# EAGLE design v2-controller (EAGLE 7.5.0)
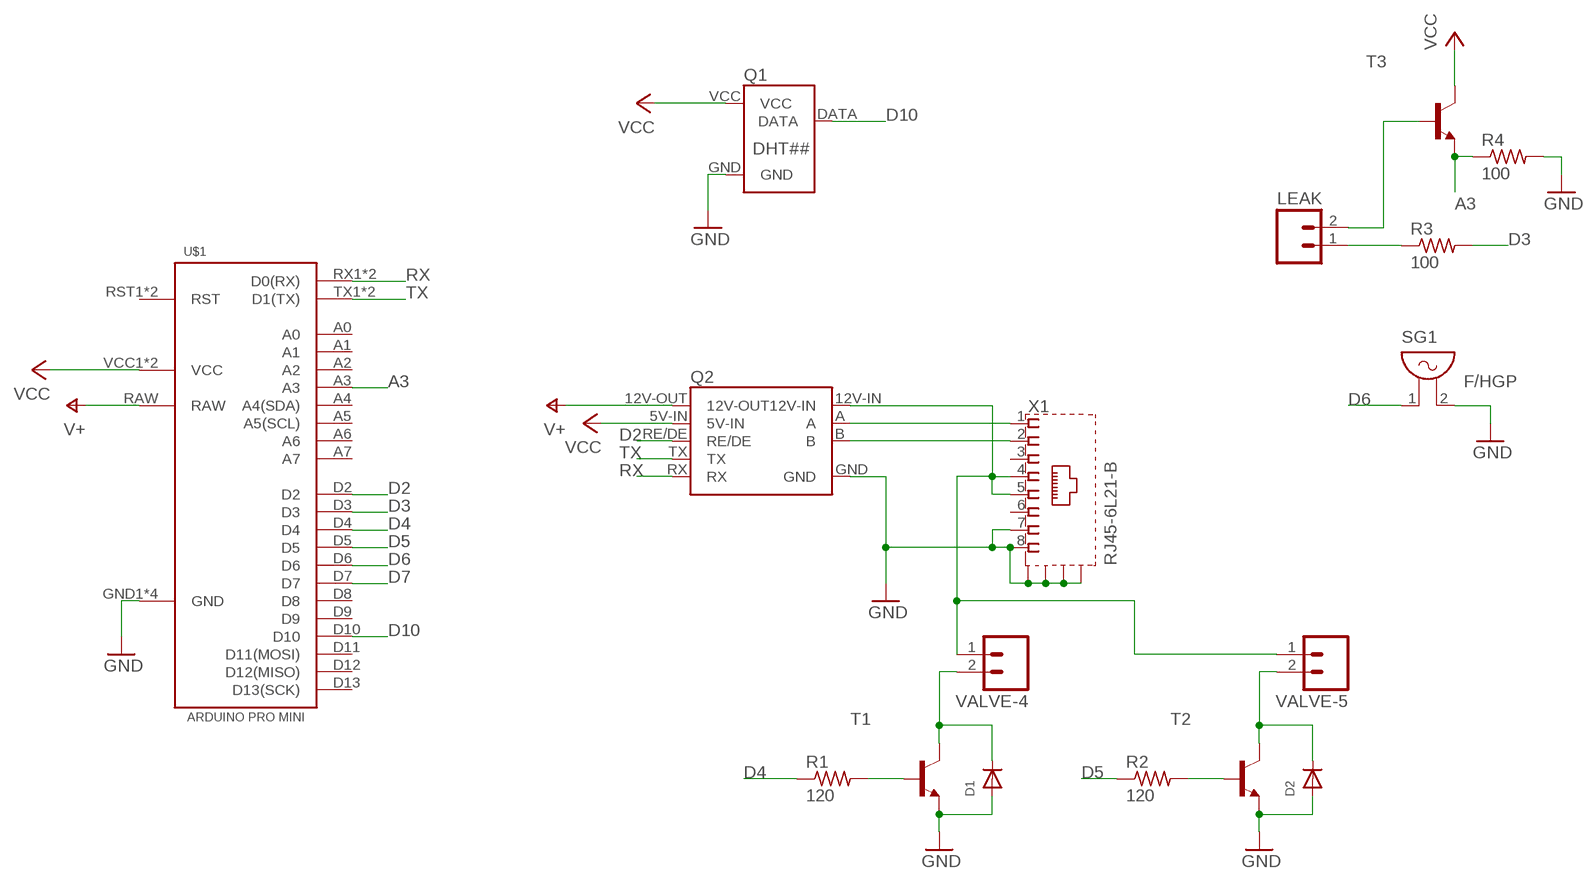
[diagram p0: schematic, sheet 1]

## Parts
D1  DIODESMA  [SMADIODE]
D2  DIODESMA  [SMADIODE]
LEAK  M02  [02P]
Q1  DHT##  [CONNECTOR-4-PIN-0.1]
Q2  RS485-ADAPTER0.05-CONNECTOR  [RS485-ADAPTOR-05]
R1  120  R-US_R0603  [R0603]
R2  120  R-US_R0603  [R0603]
R3  100  R-US_R0603  [R0603]
R4  100  R-US_R0603  [R0603]
SG1  F/HGP  [F/HGP]
T1  BC808-NPN-SOT23-BEC  [SOT23-BEC]
T2  BC808-NPN-SOT23-BEC  [SOT23-BEC]
T3  BC808-NPN-SOT23-BEC  [SOT23-BEC]
U$1  ARDUINO-PRO-MINI  [ARDUINO-PRO-MINI]
VALVE-4  M02  [02P]
VALVE-5  M02  [02P]
X1  RJ45-6L21-B  [RJ45-SHIELD1]

## Nets
A3: R4.1 T3.E U$1.A3
D2: Q2.RE/DE U$1.D2
D3: R3.2 U$1.D3
D4: R1.1 U$1.D4
D5: R2.1 U$1.D5
D6: SG1.1 U$1.D6
D7: U$1.D7
D10: Q1.DATA U$1.D10
GND: D1.A D2.A Q1.GND Q2.GND R4.2 SG1.2 T1.E T2.E U$1.GND1(GND) U$1.GND2(GND) U$1.GND3(GND) U$1.GND4(GND) X1.7 X1.8 X1.S1(S) X1.S2(S) X1.S3(S) X1.S4(S)
N$1: LEAK.1 R3.1
N$2: R1.2 T1.B
N$3: LEAK.2 T3.B
N$5: Q2.12V-IN VALVE-4.1 VALVE-5.1 X1.4 X1.5
N$6: D2.C T2.C VALVE-5.2
N$7: Q2.B X1.2
N$8: Q2.A X1.1
N$9: D1.C T1.C VALVE-4.2
N$10: R2.2 T2.B
RX: Q2.RX U$1.RX1(D0(RX)) U$1.RX2(D0(RX))
TX: Q2.TX U$1.TX1(D1(TX)) U$1.TX2(D1(TX))
V+: Q2.12V-OUT U$1.RAW
VCC: Q1.VCC Q2.5V-IN T3.C U$1.VCC1(VCC) U$1.VCC2(VCC)
Unconnected: U$1.A0 U$1.A1 U$1.A2 U$1.A4(A4(SDA)) U$1.A5(A5(SCL)) U$1.A6 U$1.A7 U$1.D8 U$1.D9 U$1.D11(D11(MOSI)) U$1.D12(D12(MISO)) U$1.D13(D13(SCK)) U$1.RST1(RST) U$1.RST2(RST) X1.3 X1.6

## Library data of the parts
D1 D2 = adafruit:DIODE: Diode SMADIODE - SMA Surface Mount Package 20V 1A Schottky Diode Digikey: 641-1014-6-ND DO-1N4148 - Through Hole Small Current Diode SOD-123 20V 1 A (.5mV Vf) Schottky Diode - Digikey: MBRX120TPMSCT-ND SOD-323 10V 570mA (.38mV Vf, 3ns) Schottky Diode - Digikey: ZLLS410CT-ND SOD-523 30V 30mA Schottky Diode (RB751S-40TE61) - Digikey: RB751S-40TE61CT-ND SOT23-R/W - SOT23 Package (R = Solder Paste/Reflow Ovens, W = Hand-Soldering) BAT54Film 40V 300mA - Digikey: 497-7162-1-ND
LEAK VALVE-4 VALVE-5 = con-amp-quick:M02: AMP QUICK CONNECTOR; OC_FARNELL: unknown; OC_NEWARK: unknown
Q1 = serge:DHT##
Q2 = serge:RS485-ADAPTER
R1-R4 = adafruit:R-US_: RESISTOR, American symbol
SG1 = buzzer:F/HGP: BUZZER Source: Buerklin; OC_FARNELL: unknown; OC_NEWARK: unknown
T1-T3 = transistor:*-NPN-: NPN Transistror BF959 corrected 2008.03.06
U$1 = serge:ARDUINO-PRO-MINI
X1 = con-tycoelectronics:RJ45*2: RJ45 Low Profile Shield Type 2 For all RJ45 L, LC, LCT and X Series Models Source: www.tycoelectronics.com .. ENG_DS_1654001_1099_RJ_L_0507.pdf; OC_FARNELL: unknown; OC_NEWARK: unknown

## Board
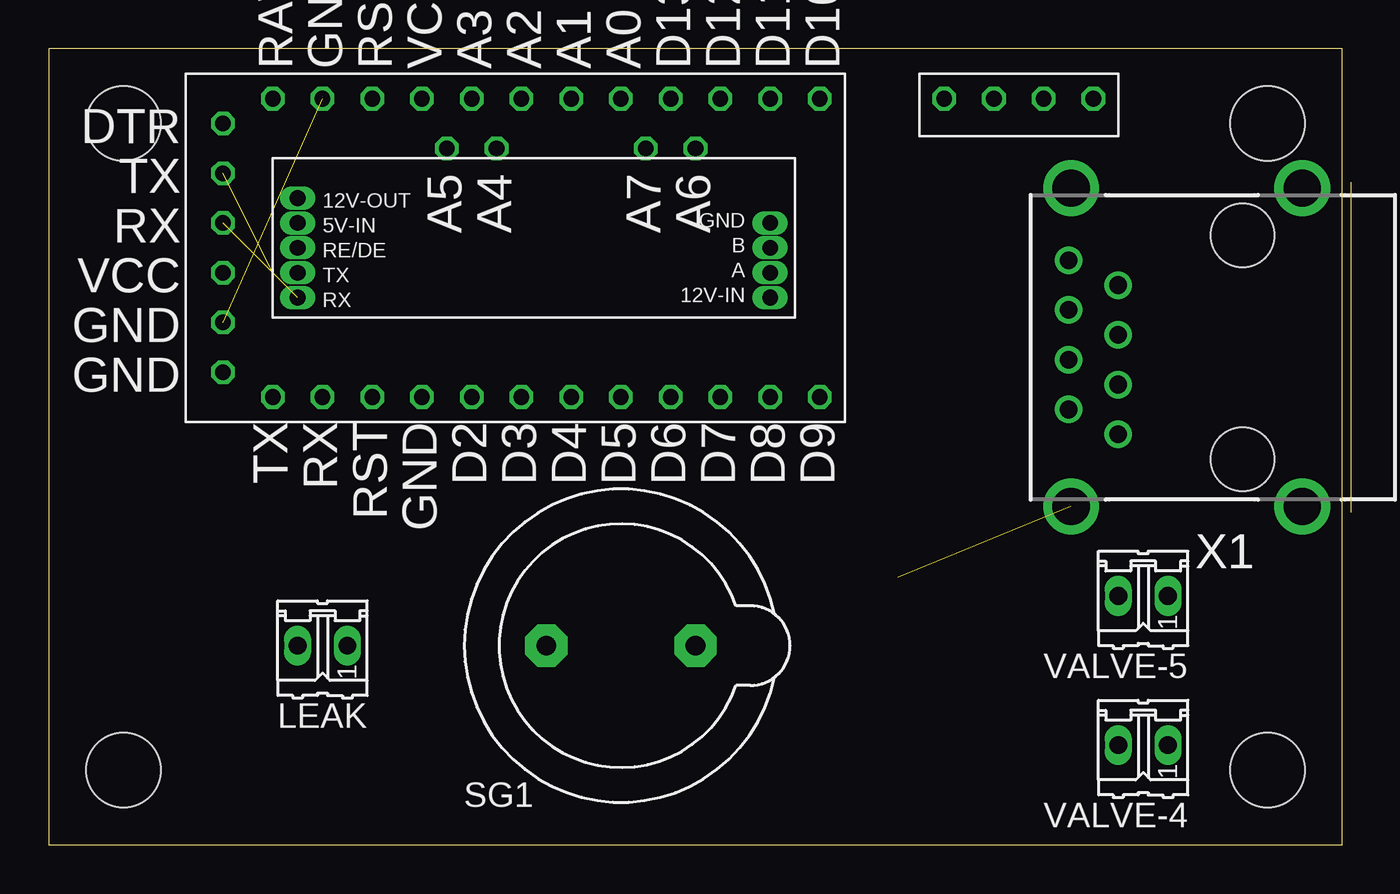
[diagram p1: board, top side]
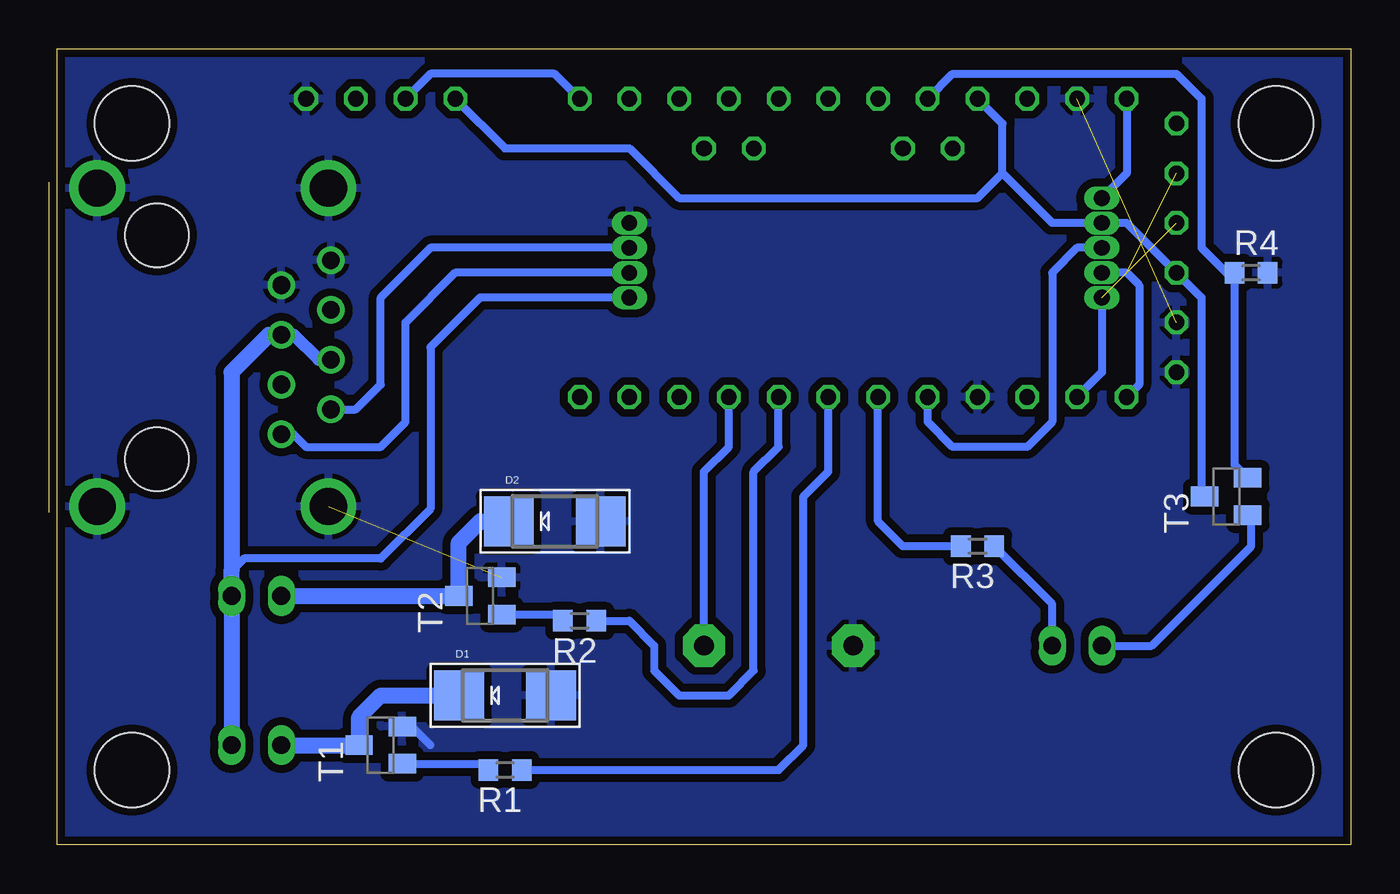
[diagram p2: board, bottom side, seen from below]

Size 66.04 x 40.64 mm. Coordinates in mm from the lower left corner, seen from the top.
Outline: 0,0 66.04,0 66.04,40.64 0,40.64 0,0
Copper layers (1*16): Top 0.035mm / dielectric 1.5mm / Bottom 0.035mm
Design rules "default *": minimum track width 10mil, minimum drill 24mil, track to track 16mil, track to pad 16mil, pad to pad 16mil, via to via 16mil, smd to smd 16mil, copper to edge 16mil, drill to drill 8mil, minimum pad ring 8mil, minimum via ring 8mil, stop-mask expansion 4mil, vias tented up to drill 0mil, thermal gap 10mil
Holes 3.81 mm at 3.81,3.81 3.81,36.83 62.23,36.83 62.23,3.81

### Footprints (pad centres in the part's own frame; a part is rotated, then mirrored left to right if it is on the bottom)
SMADIODE = smd 2.54 x 2.54: A 2.349,0; C -2.349,0
02P = drill 0.914 long: 1 -1.27,0; 2 1.27,0
CONNECTOR-4-PIN-0.1 = drill 0.8 octagon: DATA -1.27,0; GND 3.81,0; N/C 1.27,0; VCC -3.81,0
RS485-ADAPTOR-05 = drill 0.8 pad 1.016 long: 5V-IN -11.43,1.27; 12V-IN 12.7,-2.54; 12V-OUT -11.43,2.54; A 12.7,-1.27; B 12.7,0; GND 12.7,1.27; RE/DE -11.43,0; RX -11.43,-2.54; TX -11.43,-1.27
R0603 = smd 1 x 1.1: 1 -0.85,0; 2 0.85,0
F/HGP = drill 1.016 pad 2.159 octagon: 1 -3.81,0; 2 3.81,0
SOT23-BEC = smd 1 x 1.4: B -0.95,-1.1; C 0,1.1; E 0.95,-1.1
ARDUINO-PRO-MINI = drill 0.8 octagon: A0 -3.81,-7.62; A1 -1.27,-7.62; A2 1.27,-7.62; A3 3.81,-7.62; A4 2.54,-5.08; A5 5.08,-5.08; A6 -7.62,-5.08; A7 -5.08,-5.08; D2 3.81,7.62; D3 1.27,7.62; D4 -1.27,7.62; D5 -3.81,7.62; D6 -6.35,7.62; D7 -8.89,7.62; D8 -11.43,7.62; D9 -13.97,7.62; D10 -13.97,-7.62; D11 -11.43,-7.62; D12 -8.89,-7.62; D13 -6.35,-7.62; DTR 16.51,-6.35; GND1 11.43,-7.62; GND2 16.51,6.35; GND3 16.51,3.81; GND4 6.35,7.62; RAW 13.97,-7.62; RST1 8.89,7.62; RST2 8.89,-7.62; RX1 11.43,7.62; RX2 16.51,-1.27; TX1 13.97,7.62; TX2 16.51,-3.81; VCC1 16.51,1.27; VCC2 6.35,-7.62
RJ45-SHIELD1 = drill 0.9 pad 1.4: 1 -4.445,6.35; 2 -3.175,8.89; 3 -1.905,6.35; 4 -0.635,8.89; 5 0.635,6.35; 6 1.905,8.89; 7 3.175,6.35; 8 4.445,8.89 | drill 1.9 pad 2.5: S1 -8.128,-3.048; S2 8.128,-3.048; S3 -8.128,8.76; S4 8.128,8.76 | hole 3.251: -5.715,0; 5.715,0

### Placement (x,y rotation side)
D1  43.18,7.62 0 bottom
D2  40.64,16.51 0 bottom
LEAK  13.97,10.16 180 top
Q1  49.53,38.1 0 top
Q2  24.13,30.48 0 top
R1  43.18,3.81 180 bottom
R2  39.37,11.43 180 bottom
R3  19.05,15.24 180 bottom
R4  5.08,29.21 0 bottom
SG1  29.21,10.16 180 top
T1  49.53,5.08 90 bottom
T2  44.45,12.7 90 bottom
T3  6.35,17.78 90 bottom
U$1  25.4,30.48 180 top
VALVE-4  55.88,5.08 180 top
VALVE-5  55.88,12.7 180 top
X1  60.96,25.4 90 top

### Tracks (layer width: path | path; a pad name or v marks a point on that pad's centre or on a via)
A3
  Bottom 0.406: U$1.A3 20.32,39.37 8.89,39.37 7.62,38.1 7.62,30.48 6.35,29.21 R4.1 5.93,19.41 T3.E
D2
  Bottom 0.406: Q2.RE/DE 13.97,30.48 15.24,29.21 15.24,21.59 16.51,20.32 20.32,20.32 21.59,21.59 U$1.D2
D3
  Bottom 0.406: R3.2 22.86,15.24 24.13,16.51 U$1.D3
D4
  Bottom 0.406: U$1.D4 26.67,19.05 27.94,17.78 27.94,5.08 29.21,3.81 R1.1
D5
  Bottom 0.406: R2.1 36.83,11.43 35.56,10.16 35.56,8.89 34.29,7.62 31.75,7.62 30.48,8.89 30.48,19.05 29.21,20.32 U$1.D5
D6
  Bottom 0.406: SG1.1 33.02,19.05 31.75,20.32 U$1.D6
D10
  Bottom 0.406: U$1.D10 40.64,39.37 46.99,39.37 Q1.DATA
GND  (2 unrouted)
  Bottom 0.406: T1.E 47.94,6.03 46.99,5.08
  pour Bottom: 0,40.64 66.04,40.64 66.04,0 0,0
N$1
  Bottom 0.406: LEAK.1 15.24,12.28 R3.1
N$2
  Bottom 0.406: T1.B 44.35,4.13 R1.2
N$3
  Bottom 0.406: LEAK.2 10.16,10.16 5.08,15.24 5.08,16.66 T3.B
N$5
  Bottom 0.406: 57.15,13.97 56.52,14.61 49.53,14.61 46.99,17.14 46.99,25.4 44.45,27.94 Q2.12V-IN
  Bottom 0.61: X1.4 52.7,24.77 53.98,26.04 X1.5
  Bottom 0.813: X1.5 55.24,26.04 57.15,24.13 57.15,13.97 VALVE-5.1 VALVE-4.1
N$6
  Bottom 0.813: VALVE-5.2 T2.C 45.55,15.41 44.45,16.51 D2.C
N$7
  Bottom 0.406: X1.2 50.8,22.23 49.53,23.5 49.53,27.94 46.99,30.48 Q2.B
N$8
  Bottom 0.406: X1.1 53.98,20.95 53.34,20.32 49.53,20.32 48.26,21.59 48.26,26.67 45.72,29.21 Q2.A
N$9
  Bottom 0.813: VALVE-4.2 T1.C 50.63,6.52 49.53,7.62 D1.C
N$10
  Bottom 0.406: T2.B 40.54,11.75 R2.2
RX  (1 unrouted)
  Bottom 0.406: U$1.RX1 12.7,24.13 Q2.RX
TX  (1 unrouted)
  Bottom 0.406: U$1.TX1 10.79,23.5 10.79,28.57 11.43,29.21 Q2.TX
V+
  Bottom 0.406: U$1.RAW 11.43,34.29 Q2.12V-OUT
VCC
  Bottom 0.406: T3.C 7.62,17.95 7.62,27.94 U$1.VCC1 11.43,31.75 Q2.5V-IN 15.24,31.75 17.78,34.29 | Q1.VCC 43.18,35.56 36.83,35.56 34.29,33.02 19.05,33.02 17.78,34.29 | 17.78,34.29 17.78,36.83 U$1.VCC2